# EAGLE board base-module-r1.1 (EAGLE 5.12), part 1 of 2
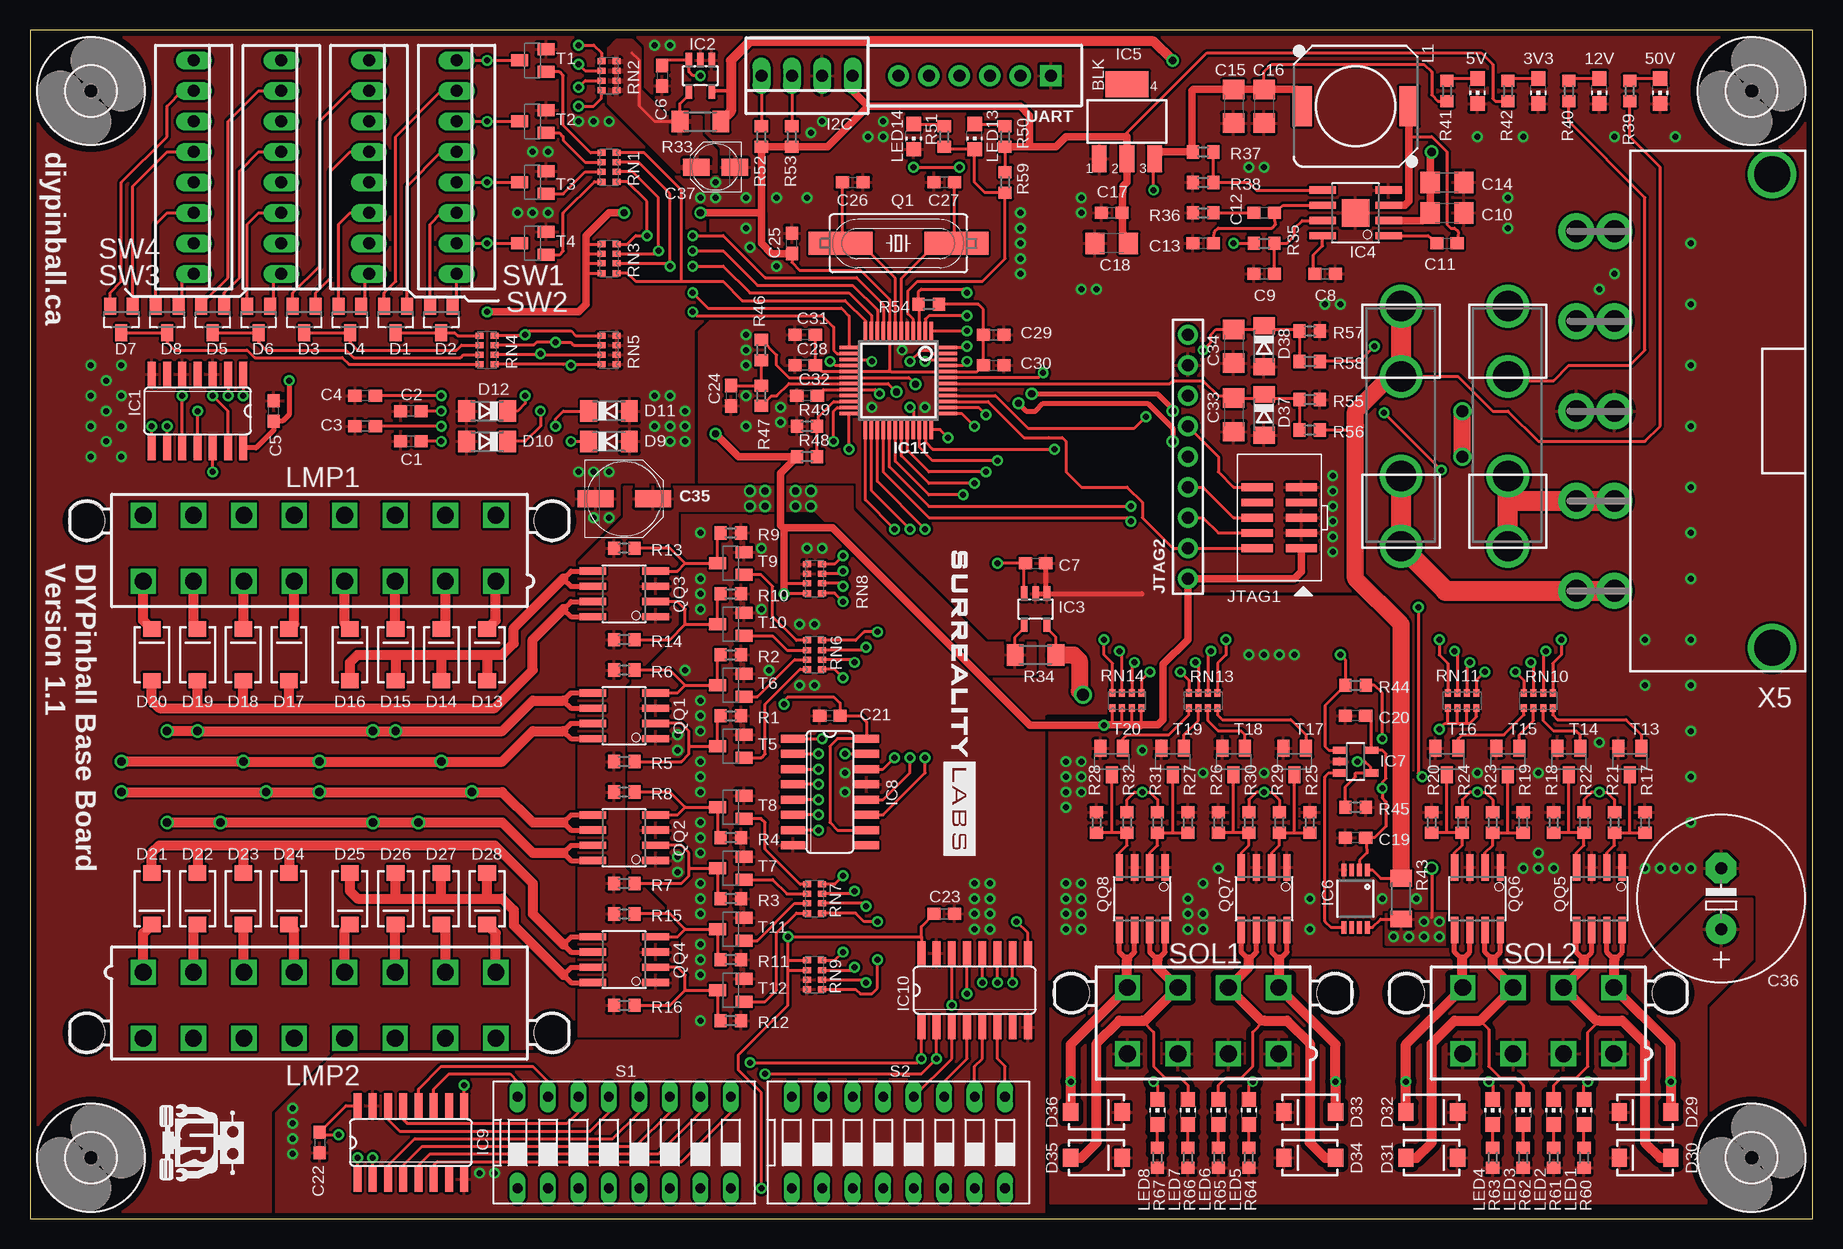
[diagram p4: board, top side]
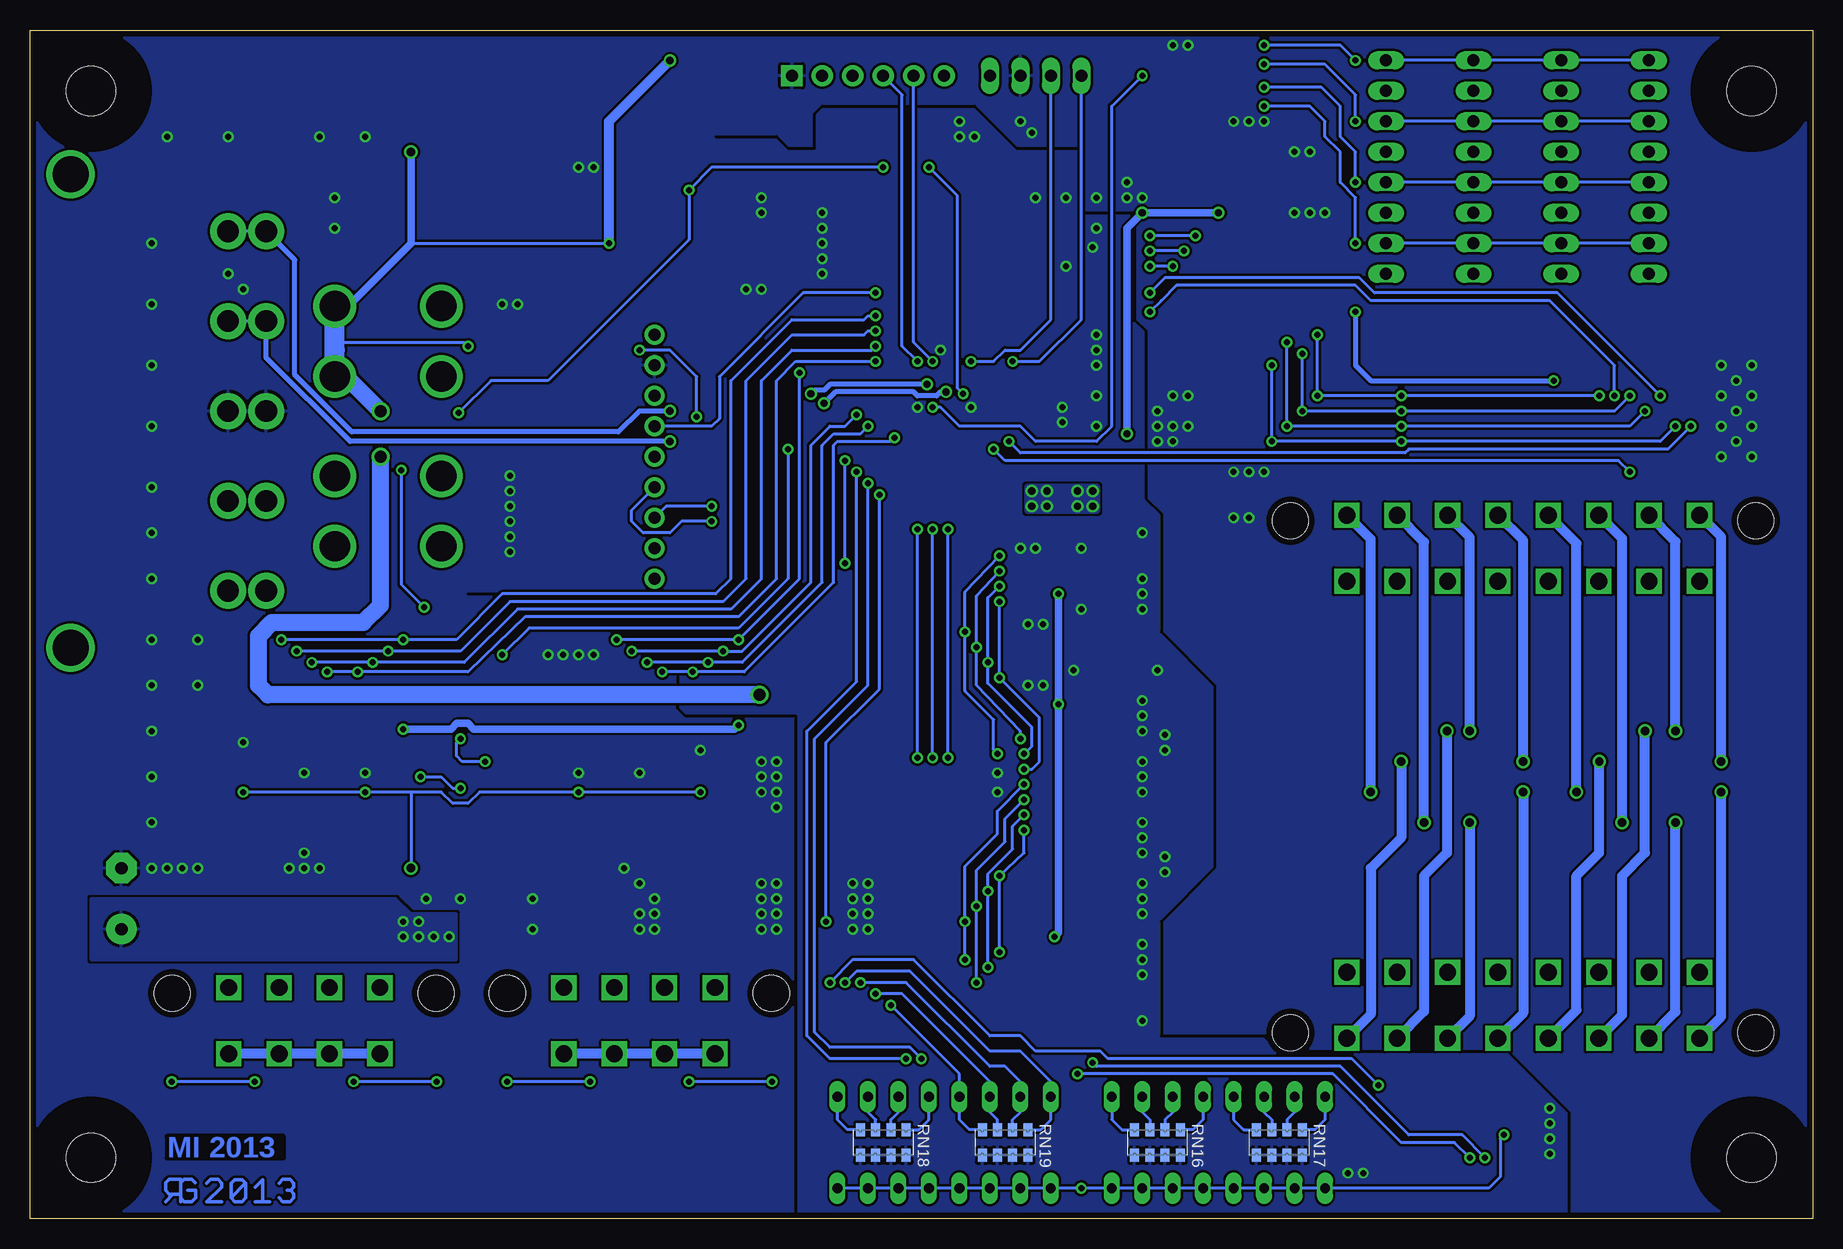
[diagram p5: board, bottom side, seen from below]

Size 148.59 x 99.06 mm. Coordinates in mm from the lower left corner, seen from the top.
Outline: 0,0 148.59,0 148.59,99.06 0,99.06 0,0
Copper layers (1*16): Top 0.035mm / dielectric 1.5mm / Bottom 0.035mm
Design rules "default *": minimum track width 10mil, minimum drill 0.5mm, track to track 8mil, track to pad 8mil, pad to pad 8mil, via to via 8mil, smd to smd 8mil, copper to edge 20mil, drill to drill 8mil, minimum pad ring 10mil, minimum via ring 8mil, stop-mask expansion 4mil, vias tented up to drill 20mil, thermal gap 10mil
Net classes: 1 HV: clearance 0.406 mm
tRestrict: 24 lines
bRestrict: 31 lines

## Footprints (pad centres in the part's own frame; a part is rotated, then mirrored left to right if it is on the bottom)
CHIP-LED0805 = smd 1.2 x 1.2: A 0,-1.05; C 0,1.05
C0603 = smd 1.1 x 1: 1 -0.85,0; 2 0.85,0
C1206 = smd 1.6 x 1.8: 1 -1.4,0; 2 1.4,0
PANASONIC_D = smd 3 x 1.4: + 2.4,0; - -2.4,0
E5-13 = drill 1.016 pad 2.54 round: + -2.54,0 | drill 1.016 pad 2.54 octagon: - 2.54,0
PANASONIC_B = smd 2.2 x 1.4: + 1.6,0; - -1.6,0
SOT23 = smd 1 x 1.4: 1 -0.95,-1.1; 2 0.95,-1.1; 3 0,1.1
SOD80C = smd 1.4 x 1.8: A 1.7,0; C -1.7,0
SMA-DIODE = smd 1.27 x 1.47: A -2.15,0; C 2.15,0
FUSE_5MM = drill 2.54 pad 3.556 round: 1 0,-10; 2 0,-4.158; 3 0,4.158; 4 0,10
4,1 = hole 4.1: 0,0
22-23-2041 = drill 1 long: 1 -3.81,0; 2 -1.27,0; 3 1.27,0; 4 3.81,0
SO14 = smd 0.66 x 2.032: 1 -3.81,-3.073; 2 -2.54,-3.073; 3 -1.27,-3.073; 4 0,-3.073; 5 1.27,-3.073; 6 2.54,-3.073; 7 3.81,-3.073; 8 3.81,3.073; 9 2.54,3.073; 10 1.27,3.073; 11 0,3.073; 12 -1.27,3.073; 13 -2.54,3.073; 14 -3.81,3.073
SOT23-5L = smd 0.55 x 1.2: 1 -0.95,-1.3; 2 0,-1.3; 3 0.95,-1.3; 4 0.95,1.3; 5 -0.95,1.3
SO08 = smd 0.61 x 2.21: 1 -1.905,-2.75; 2 -0.635,-2.75; 3 0.635,-2.75; 4 1.905,-2.75; 5 1.905,2.75; 6 0.635,2.75; 7 -0.635,2.75; 8 -1.905,2.75 | smd 2.3 x 2.3: SLUG 0,0
SOT223 = smd 1.219 x 2.235: 1 -2.311,-3.099; 2 0,-3.099; 3 2.311,-3.099 | smd 3.6 x 2.2: 4 0,3.099
MSOP-8 = smd 0.41 x 1.02: 1 -0.975,-2.4; 2 -0.325,-2.4; 3 0.325,-2.4; 4 0.975,-2.4; 5 0.975,2.4; 6 0.325,2.4; 7 -0.325,2.4; 8 -0.975,2.4
SOT23-5 = smd 0.6 x 1.2: 1 -0.95,-1.306; 2 0,-1.306; 3 0.95,-1.306; 4 0.95,1.306; 5 -0.95,1.306
SO16 = smd 0.66 x 2.032: 1 -4.445,-3.073; 2 -3.175,-3.073; 3 -1.905,-3.073; 4 -0.635,-3.073; 5 0.635,-3.073; 6 1.905,-3.073; 7 3.175,-3.073; 8 4.445,-3.073; 9 4.445,3.073; 10 3.175,3.073; 11 1.905,3.073; 12 0.635,3.073; 13 -0.635,3.073; 14 -1.905,3.073; 15 -3.175,3.073; 16 -4.445,3.073
LQFP48 = smd 0.3 x 1.6: 1 -2.75,-4.1; 2 -2.25,-4.1; 3 -1.75,-4.1; 4 -1.25,-4.1; 5 -0.75,-4.1; 6 -0.25,-4.1; 7 0.25,-4.1; 8 0.75,-4.1; 9 1.25,-4.1; 10 1.75,-4.1; 11 2.25,-4.1; 12 2.75,-4.1; 25 2.75,4.1; 26 2.25,4.1; 27 1.75,4.1; 28 1.25,4.1; 29 0.75,4.1; 30 0.25,4.1; 31 -0.25,4.1; 32 -0.75,4.1; 33 -1.25,4.1; 34 -1.75,4.1; 35 -2.25,4.1; 36 -2.75,4.1 | smd 1.6 x 0.3: 13 4.1,-2.75; 14 4.1,-2.25; 15 4.1,-1.75; 16 4.1,-1.25; 17 4.1,-0.75; 18 4.1,-0.25; 19 4.1,0.25; 20 4.1,0.75; 21 4.1,1.25; 22 4.1,1.75; 23 4.1,2.25; 24 4.1,2.75; 37 -4.1,2.75; 38 -4.1,2.25; 39 -4.1,1.75; 40 -4.1,1.25; 41 -4.1,0.75; 42 -4.1,0.25; 43 -4.1,-0.25; 44 -4.1,-0.75; 45 -4.1,-1.25; 46 -4.1,-1.75; 47 -4.1,-2.25; 48 -4.1,-2.75
2X05_1.27MM_SMT = smd 0.65 x 2.6: 1 -2.54,-1.85; 2 -2.54,1.85; 3 -1.27,-1.85; 4 -1.27,1.85; 5 0,-1.85; 6 0,1.85; 7 1.27,-1.85; 8 1.27,1.85; 9 2.54,-1.85; 10 2.54,1.85
100MIL-9 = drill 1 pad 1.676 round: 1 -10.16,0; 2 -7.62,0; 3 -5.08,0; 4 -2.54,0; 5 0,0; 6 2.54,0; 7 5.08,0; 8 7.62,0; 9 10.16,0
DR1030 = smd 3.3 x 1.6: 1 0,4.45; 2 0,-4.45
5566-16 = drill 1.4 square: 1 14.7,-2.75; 2 10.5,-2.75; 3 6.3,-2.75; 4 2.1,-2.75; 5 -2.1,-2.75; 6 -6.3,-2.75; 7 -10.5,-2.75; 8 -14.7,-2.75; 9 14.7,2.75; 10 10.5,2.75; 11 6.3,2.75; 12 2.1,2.75; 13 -2.1,2.75; 14 -6.3,2.75; 15 -10.5,2.75; 16 -14.7,2.75 | hole 3: 19.4,2.29; -19.4,2.29
HC49UP = smd 5.334 x 1.93: 1 -4.826,0; 2 4.826,0
SO-8 = smd 2.21 x 0.61: 1 -2.616,1.905; 2 -2.616,0.635; 3 -2.616,-0.635; 4 -2.616,-1.905; 5 2.616,-1.905; 6 2.616,-0.635; 7 2.616,0.635; 8 2.616,1.905
R0603 = smd 1 x 1.1: 1 -0.85,0; 2 0.85,0
M3516 = smd 1.4 x 1.8: 1 -1.7,0; 2 1.7,0
0603-ARC = smd 0.5 x 0.65: 1 -1.2,-0.625; 2 -0.4,-0.625; 3 0.4,-0.625; 4 1.2,-0.625; 5 1.2,0.625; 6 0.4,0.625; 7 -0.4,0.625; 8 -1.2,0.625
EXBS8V = smd 0.75 x 1.1: 1 -1.905,-1.07; 2 -0.635,-1.07; 3 0.635,-1.07; 4 1.905,-1.07; 5 1.905,1.07; 6 0.635,1.07; 7 -0.635,1.07; 8 -1.905,1.07
DS-08 = drill 0.813 long: 1 -8.89,-3.81; 2 -6.35,-3.81; 3 -3.81,-3.81; 4 -1.27,-3.81; 5 1.27,-3.81; 6 3.81,-3.81; 7 6.35,-3.81; 8 8.89,-3.81; 9 8.89,3.81; 10 6.35,3.81; 11 3.81,3.81; 12 1.27,3.81; 13 -1.27,3.81; 14 -3.81,3.81; 15 -6.35,3.81; 16 -8.89,3.81
5566-8 = drill 1.4 square: 1 6.3,-2.75; 2 2.1,-2.75; 3 -2.1,-2.75; 4 -6.3,-2.75; 5 6.3,2.75; 6 2.1,2.75; 7 -2.1,2.75; 8 -6.3,2.75 | hole 3: 11,2.29; -11,2.29
22-23-2081 = drill 1 long: 1 -8.89,0; 2 -6.35,0; 3 -3.81,0; 4 -1.27,0; 5 1.27,0; 6 3.81,0; 7 6.35,0; 8 8.89,0
SOT23-BEC = smd 1 x 1.4: B -0.95,-1.1; C 0,1.1; E 0.95,-1.1
USBCABLE-0.100-NOLBL = drill 1 pad 1.778 square: 1 0,-7.62 | drill 1 pad 1.778 round: 2 0,-5.08; 3 0,-2.54; 4 0,0; 5 0,2.54; 6 0,5.08
43160-XX05 = drill 1.8 pad 3 round: 1@1 -14.98,0; 1@2 -14.98,3.18; 2@1 -7.49,0; 2@2 -7.49,3.18; 3@1 0,0; 3@2 0,3.18; 4@1 7.49,0; 4@2 7.49,3.18; 5@1 14.98,0; 5@2 14.98,3.18 | drill 3 pad 3.4 round: M1 -19.73,-13.13; M2 19.73,-13.13

## Placement (x,y rotation side)
3V3  3.3V  [CHIP-LED0805]  125.73,93.98 180 top
5V  5V  [CHIP-LED0805]  120.65,93.98 180 top
12V  12V  [CHIP-LED0805]  130.81,93.98 180 top
50V  PWR  [CHIP-LED0805]  135.89,93.98 180 top
C1  CYA  [C0603]  31.75,64.77 180 top
C2  CYA  [C0603]  31.75,67.31 180 top
C3  CYA  [C0603]  27.94,66.04 180 top
C4  CYA  [C0603]  27.94,68.58 180 top
C5  100n  [C0603]  20.32,67.31 90 top
C6  .047  [C0603]  52.7,95.25 270 top
C7  .047  [C0603]  83.82,54.61 0 top
C8  100n  [C0603]  107.95,78.74 0 top
C9  100n  [C0603]  102.87,78.74 180 top
C10  10u  [C1206]  118.11,83.82 0 top
C11  100n  [C0603]  118.11,81.28 0 top
C12  3.3n  [C0603]  102.87,83.82 180 top
C13  DNP  [C0603]  97.79,81.28 180 top
C14  10u  [C1206]  118.11,86.36 0 top
C15  22u  [C1206]  100.33,92.71 270 top
C16  22u  [C1206]  102.87,92.71 270 top
C17  2.2u  [C0603]  90.17,83.82 180 top
C18  10u  [C1206]  90.17,81.28 180 top
C19  100n  [C0603]  110.49,31.75 180 top
C20  100n  [C0603]  110.49,41.91 180 top
C21  100n  [C0603]  66.67,41.91 180 top
C22  100n  [C0603]  24.13,6.35 270 top
C23  100n  [C0603]  76.2,25.4 0 top
C24  1n  [C0603]  58.42,68.58 270 top
C25  10n  [C0603]  63.5,81.28 90 top
C26  18p  [C0603]  68.58,86.36 0 top
C27  18p  [C0603]  76.2,86.36 180 top
C28  10n  [C0603]  64.61,71.12 180 top
C29  10n  [C0603]  80.33,73.66 0 top
C30  100n  [C0603]  80.33,71.12 0 top
C31  100n  [C0603]  64.61,73.66 180 top
C32  100n  [C0603]  64.77,68.58 180 top
C33  10u  [C1206]  100.33,66.99 270 top
C34  10u  [C1206]  100.33,72.71 270 top
C35  100u  [PANASONIC_D]  49.53,60.01 0 top
C36  220u  [E5-13]  140.97,26.67 90 top
C37  10u  [PANASONIC_B]  57.15,87.63 180 top
D1  BAT54C  [SOT23]  30.48,74.93 180 top
D2  BAT54C  [SOT23]  34.29,74.93 180 top
D3  BAT54C  [SOT23]  22.86,74.93 180 top
D4  BAT54C  [SOT23]  26.67,74.93 180 top
D5  BAT54C  [SOT23]  15.24,74.93 180 top
D6  BAT54C  [SOT23]  19.05,74.93 180 top
D7  BAT54C  [SOT23]  7.62,74.93 180 top
D8  BAT54C  [SOT23]  11.43,74.93 180 top
D9  [SOD80C]  48.26,64.77 0 top
D10  [SOD80C]  38.1,64.77 180 top
D11  [SOD80C]  48.26,67.31 0 top
D12  [SOD80C]  38.1,67.31 180 top
D13  [SMA-DIODE]  38.1,46.99 90 top
D14  [SMA-DIODE]  34.29,46.99 90 top
D15  [SMA-DIODE]  30.48,46.99 90 top
D16  [SMA-DIODE]  26.67,46.99 90 top
D17  [SMA-DIODE]  21.59,46.99 90 top
D18  [SMA-DIODE]  17.78,46.99 90 top
D19  [SMA-DIODE]  13.97,46.99 90 top
D20  [SMA-DIODE]  10.16,46.99 90 top
D21  [SMA-DIODE]  10.16,26.67 270 top
D22  [SMA-DIODE]  13.97,26.67 270 top
D23  [SMA-DIODE]  17.78,26.67 270 top
D24  [SMA-DIODE]  21.59,26.67 270 top
D25  [SMA-DIODE]  26.67,26.67 270 top
D26  [SMA-DIODE]  30.48,26.67 270 top
D27  [SMA-DIODE]  34.29,26.67 270 top
D28  [SMA-DIODE]  38.1,26.67 270 top
D29  [SMA-DIODE]  134.62,8.89 180 top
D30  [SMA-DIODE]  134.62,5.08 180 top
D31  [SMA-DIODE]  116.84,5.08 0 top
D32  [SMA-DIODE]  116.84,8.89 0 top
D33  S1M-FDICT-ND  [SMA-DIODE]  106.68,8.89 180 top
D34  S1M-FDICT-ND  [SMA-DIODE]  106.68,5.08 180 top
D35  S1M-FDICT-ND  [SMA-DIODE]  88.9,5.08 0 top
D36  S1M-FDICT-ND  [SMA-DIODE]  88.9,8.89 0 top
D37  [SOD80C]  102.87,66.99 270 top
D38  [SOD80C]  102.87,72.71 270 top
F1  FUSEX20MM(50A)  [FUSE_5MM]  114.3,66.04 0 top
F2  FUSEX20MM(25A)  [FUSE_5MM]  123.19,66.04 0 top
H1  MOUNT-HOLE4.1  [4,1]  5.08,5.08 0 top
H2  MOUNT-HOLE4.1  [4,1]  143.51,5.08 0 top
H3  MOUNT-HOLE4.1  [4,1]  5.08,93.98 0 top
H4  MOUNT-HOLE4.1  [4,1]  143.51,93.98 0 top
I2C  22-23-2041  [22-23-2041]  64.77,95.25 180 top
IC1  74HC14D  [SO14]  13.97,67.31 180 top
IC2  TS1102  [SOT23-5L]  55.88,95.25 180 top
IC3  TS1102  [SOT23-5L]  83.82,50.8 180 top
IC4  RT7247A  [SO08]  110.49,83.82 90 top
IC5  LM1117-3.3V  [SOT223]  91.44,91.44 0 top
IC6  LMP8480MM  [MSOP-8]  110.49,26.67 180 top
IC7  MCP6001  [SOT23-5]  110.49,38.1 270 top
IC8  74HC595D  [SO16]  66.67,35.56 270 top
IC9  74HC165D  [SO16]  31.75,6.35 0 top
IC10  74HC165D  [SO16]  78.74,19.05 0 top
IC11  LPC11C22/24-LQFP48  [LQFP48]  72.39,69.85 180 top
JTAG1  [2X05_1.27MM_SMT]  104.14,58.42 90 top
JTAG2  M09-100MIL  [100MIL-9]  96.52,63.5 90 top
L1  10uH  [DR1030]  110.49,92.71 270 top
LED1  [CHIP-LED0805]  129.54,8.89 0 top
LED2  [CHIP-LED0805]  127,8.89 0 top
LED3  [CHIP-LED0805]  124.46,8.89 0 top
LED4  [CHIP-LED0805]  121.92,8.89 0 top
LED5  [CHIP-LED0805]  101.6,8.89 0 top
LED6  [CHIP-LED0805]  99.06,8.89 0 top
LED7  [CHIP-LED0805]  96.52,8.89 0 top
LED8  [CHIP-LED0805]  93.98,8.89 0 top
LED13  HBB  [CHIP-LED0805]  78.74,90.17 180 top
LED14  HBA  [CHIP-LED0805]  73.66,90.17 180 top
LMP1  [5566-16]  24.13,55.88 0 top
LMP2  [5566-16]  24.13,17.78 180 top
Q1  12MHz  [HC49UP]  72.39,81.28 0 top
QQ1  DMN6040SSD  [SO-8]  49.53,41.91 180 top
QQ2  DMN6040SSD  [SO-8]  49.53,31.75 180 top
QQ3  IRF9362  [SO-8]  49.53,52.07 180 top
QQ4  IRF9362  [SO-8]  49.53,21.59 180 top
QQ5  DMN6040SSD  [SO-8]  130.81,26.67 270 top
QQ6  DMN6040SSD  [SO-8]  120.65,26.67 270 top
QQ7  DMN6040SSD  [SO-8]  102.87,26.67 270 top
QQ8  DMN6040SSD  [SO-8]  92.71,26.67 270 top
R1  100K  [R0603]  58.42,41.91 180 top
R2  100K  [R0603]  58.42,46.99 180 top
R3  100K  [R0603]  58.42,26.67 180 top
R4  100K  [R0603]  58.42,31.75 180 top
R5  68K  [R0603]  49.53,38.1 180 top
R6  68K  [R0603]  49.53,45.72 180 top
R7  68K  [R0603]  49.53,27.94 180 top
R8  68K  [R0603]  49.53,35.56 180 top
R9  100K  [R0603]  58.42,57.15 180 top
R10  100K  [R0603]  58.42,52.07 180 top
R11  100K  [R0603]  58.42,21.59 180 top
R12  100K  [R0603]  58.42,16.51 180 top
R13  1.5K  [R0603]  49.53,55.88 180 top
R14  1.5K  [R0603]  49.53,48.26 180 top
R15  1.5K  [R0603]  49.53,25.4 180 top
R16  1.5K  [R0603]  49.53,17.78 180 top
R17  100K  [R0603]  134.62,33.02 270 top
R18  100K  [R0603]  127,33.02 270 top
R19  100K  [R0603]  124.46,33.02 270 top
R20  100K  [R0603]  116.84,33.02 270 top
R21  240K  [R0603]  132.08,33.02 90 top
R22  240K  [R0603]  129.54,33.02 90 top
R23  240K  [R0603]  121.92,33.02 90 top
R24  240K  [R0603]  119.38,33.02 90 top
R25  100K  [R0603]  106.68,33.02 270 top
R26  100K  [R0603]  99.06,33.02 270 top
R27  100K  [R0603]  96.52,33.02 270 top
R28  100K  [R0603]  88.9,33.02 270 top
R29  240K  [R0603]  104.14,33.02 90 top
R30  240K  [R0603]  101.6,33.02 90 top
R31  240K  [R0603]  93.98,33.02 90 top
R32  240K  [R0603]  91.44,33.02 90 top
R33  0.02(MCS1632R020FER)  [M3516]  55.88,91.44 180 top
R34  0.003(PMR18EZPFV3L00)  [M3516]  83.82,46.99 180 top
R35  100K  [R0603]  102.87,81.28 180 top
R36  20K  [R0603]  97.79,83.82 0 top
R37  62K  [R0603]  97.79,88.9 180 top
R38  11.8K  [R0603]  97.79,86.36 0 top
R39  2.2K  [R0603]  133.35,93.98 270 top
R40  1K  [R0603]  128.27,93.98 270 top
R41  330  [R0603]  118.11,93.98 270 top
R42  220  [R0603]  123.19,93.98 270 top
R43  0.001 (CSR1206-0R001F1)  [M3516]  114.3,26.67 270 top
R44  680  [R0603]  110.49,44.45 180 top
R45  1K  [R0603]  110.49,34.29 180 top
R46  60  [R0603]  60.96,72.39 90 top
R47  60  [R0603]  60.96,68.58 90 top
R48  DNP  [R0603]  64.77,63.5 180 top
R49  0  [R0603]  64.77,66.04 180 top
R50  100  [R0603]  81.28,90.17 270 top
R51  100  [R0603]  76.2,90.17 270 top
R52  10K  [R0603]  60.96,90.17 270 top
R53  10K  [R0603]  63.5,90.17 270 top
R54  12K  [R0603]  74.93,76.2 0 top
R55  100K  [R0603]  106.68,68.26 180 top
R56  1.6M  [R0603]  106.68,65.72 0 top
R57  100K  [R0603]  106.68,73.98 180 top
R58  300K  [R0603]  106.68,71.44 0 top
R59  100K  [R0603]  81.28,86.36 90 top
R60  2.2K  [R0603]  129.54,5.08 270 top
R61  2.2K  [R0603]  127,5.08 270 top
R62  2.2K  [R0603]  124.46,5.08 270 top
R63  2.2K  [R0603]  121.92,5.08 270 top
R64  2.2K  [R0603]  101.6,5.08 270 top
R65  2.2K  [R0603]  99.06,5.08 270 top
R66  2.2K  [R0603]  96.52,5.08 270 top
R67  2.2K  [R0603]  93.98,5.08 270 top
RN1  1K  [0603-ARC]  48.26,87.63 90 top
RN2  10K  [0603-ARC]  48.26,95.25 270 top
RN3  10K  [0603-ARC]  48.26,80.01 90 top
RN4  1K  [0603-ARC]  38.1,72.39 270 top
RN5  10K  [0603-ARC]  48.26,72.39 90 top
RN6  1K  [0603-ARC]  65.41,46.99 90 top
RN7  1K  [0603-ARC]  65.41,26.67 90 top
RN8  10K  [0603-ARC]  65.41,53.34 90 top
RN9  10K  [0603-ARC]  65.41,20.32 270 top
RN10  1K  [0603-ARC]  125.73,43.18 180 top
RN11  10K  [0603-ARC]  119.38,43.18 180 top
RN13  1K  [0603-ARC]  97.79,43.18 180 top
RN14  10K  [0603-ARC]  91.44,43.18 180 top
RN16  10K  [EXBS8V]  54.61,6.35 0 bottom
RN17  10K  [EXBS8V]  44.45,6.35 0 bottom
RN18  10K  [EXBS8V]  77.47,6.35 0 bottom
RN19  10K  [EXBS8V]  67.31,6.35 0 bottom
S1  219-8MST  [DS-08]  49.53,6.35 0 top
S2  219-8MST  [DS-08]  72.39,6.35 0 top
SOL1  [5566-8]  97.79,16.51 0 top
SOL2  [5566-8]  125.73,16.51 0 top
SW1  22-23-2081  [22-23-2081]  35.56,87.63 270 top
SW2  22-23-2081  [22-23-2081]  28.26,87.63 270 top
SW3  22-23-2081  [22-23-2081]  20.95,87.63 270 top
SW4  22-23-2081  [22-23-2081]  13.65,87.63 270 top
T1  MMBT3904  [SOT23-BEC]  41.91,96.52 90 top
T2  MMBT3904  [SOT23-BEC]  41.91,91.44 90 top
T3  MMBT3904  [SOT23-BEC]  41.91,86.36 90 top
T4  MMBT3904  [SOT23-BEC]  41.91,81.28 90 top
T5  MMBT3904  [SOT23-BEC]  58.42,39.37 90 top
T6  MMBT3904  [SOT23-BEC]  58.42,44.45 90 top
T7  MMBT3904  [SOT23-BEC]  58.42,29.21 90 top
T8  MMBT3904  [SOT23-BEC]  58.42,34.29 90 top
T9  MMBT3904  [SOT23-BEC]  58.42,54.61 90 top
T10  MMBT3904  [SOT23-BEC]  58.42,49.53 90 top
T11  MMBT3904  [SOT23-BEC]  58.42,24.13 90 top
T12  MMBT3904  [SOT23-BEC]  58.42,19.05 90 top
T13  MMBT3904  [SOT23-BEC]  133.35,38.1 180 top
T14  MMBT3904  [SOT23-BEC]  128.27,38.1 180 top
T15  MMBT3904  [SOT23-BEC]  123.19,38.1 180 top
T16  MMBT3904  [SOT23-BEC]  118.11,38.1 180 top
T17  MMBT3904  [SOT23-BEC]  105.41,38.1 180 top
T18  MMBT3904  [SOT23-BEC]  100.33,38.1 180 top
T19  MMBT3904  [SOT23-BEC]  95.25,38.1 180 top
T20  MMBT3904  [SOT23-BEC]  90.17,38.1 180 top
U$1  [RGLOGO_SMALL_2013]  135.89,1.27 0 bottom
U$2  [SURREALITY_LOGO_SILK]  76.2,55.88 270 top
U$3  UR_LOGO10  [UR_LOGO_10X10]  13.97,6.35 270 top
UART  TTL-232R-5VN  [USBCABLE-0.100-NOLBL]  77.47,95.25 90 top
X5  43160-3105  [43160-XX05]  132.08,67.31 90 top